# Altium schematic sheet EA08AI测试板.SchDoc
size 711 x 711 mm
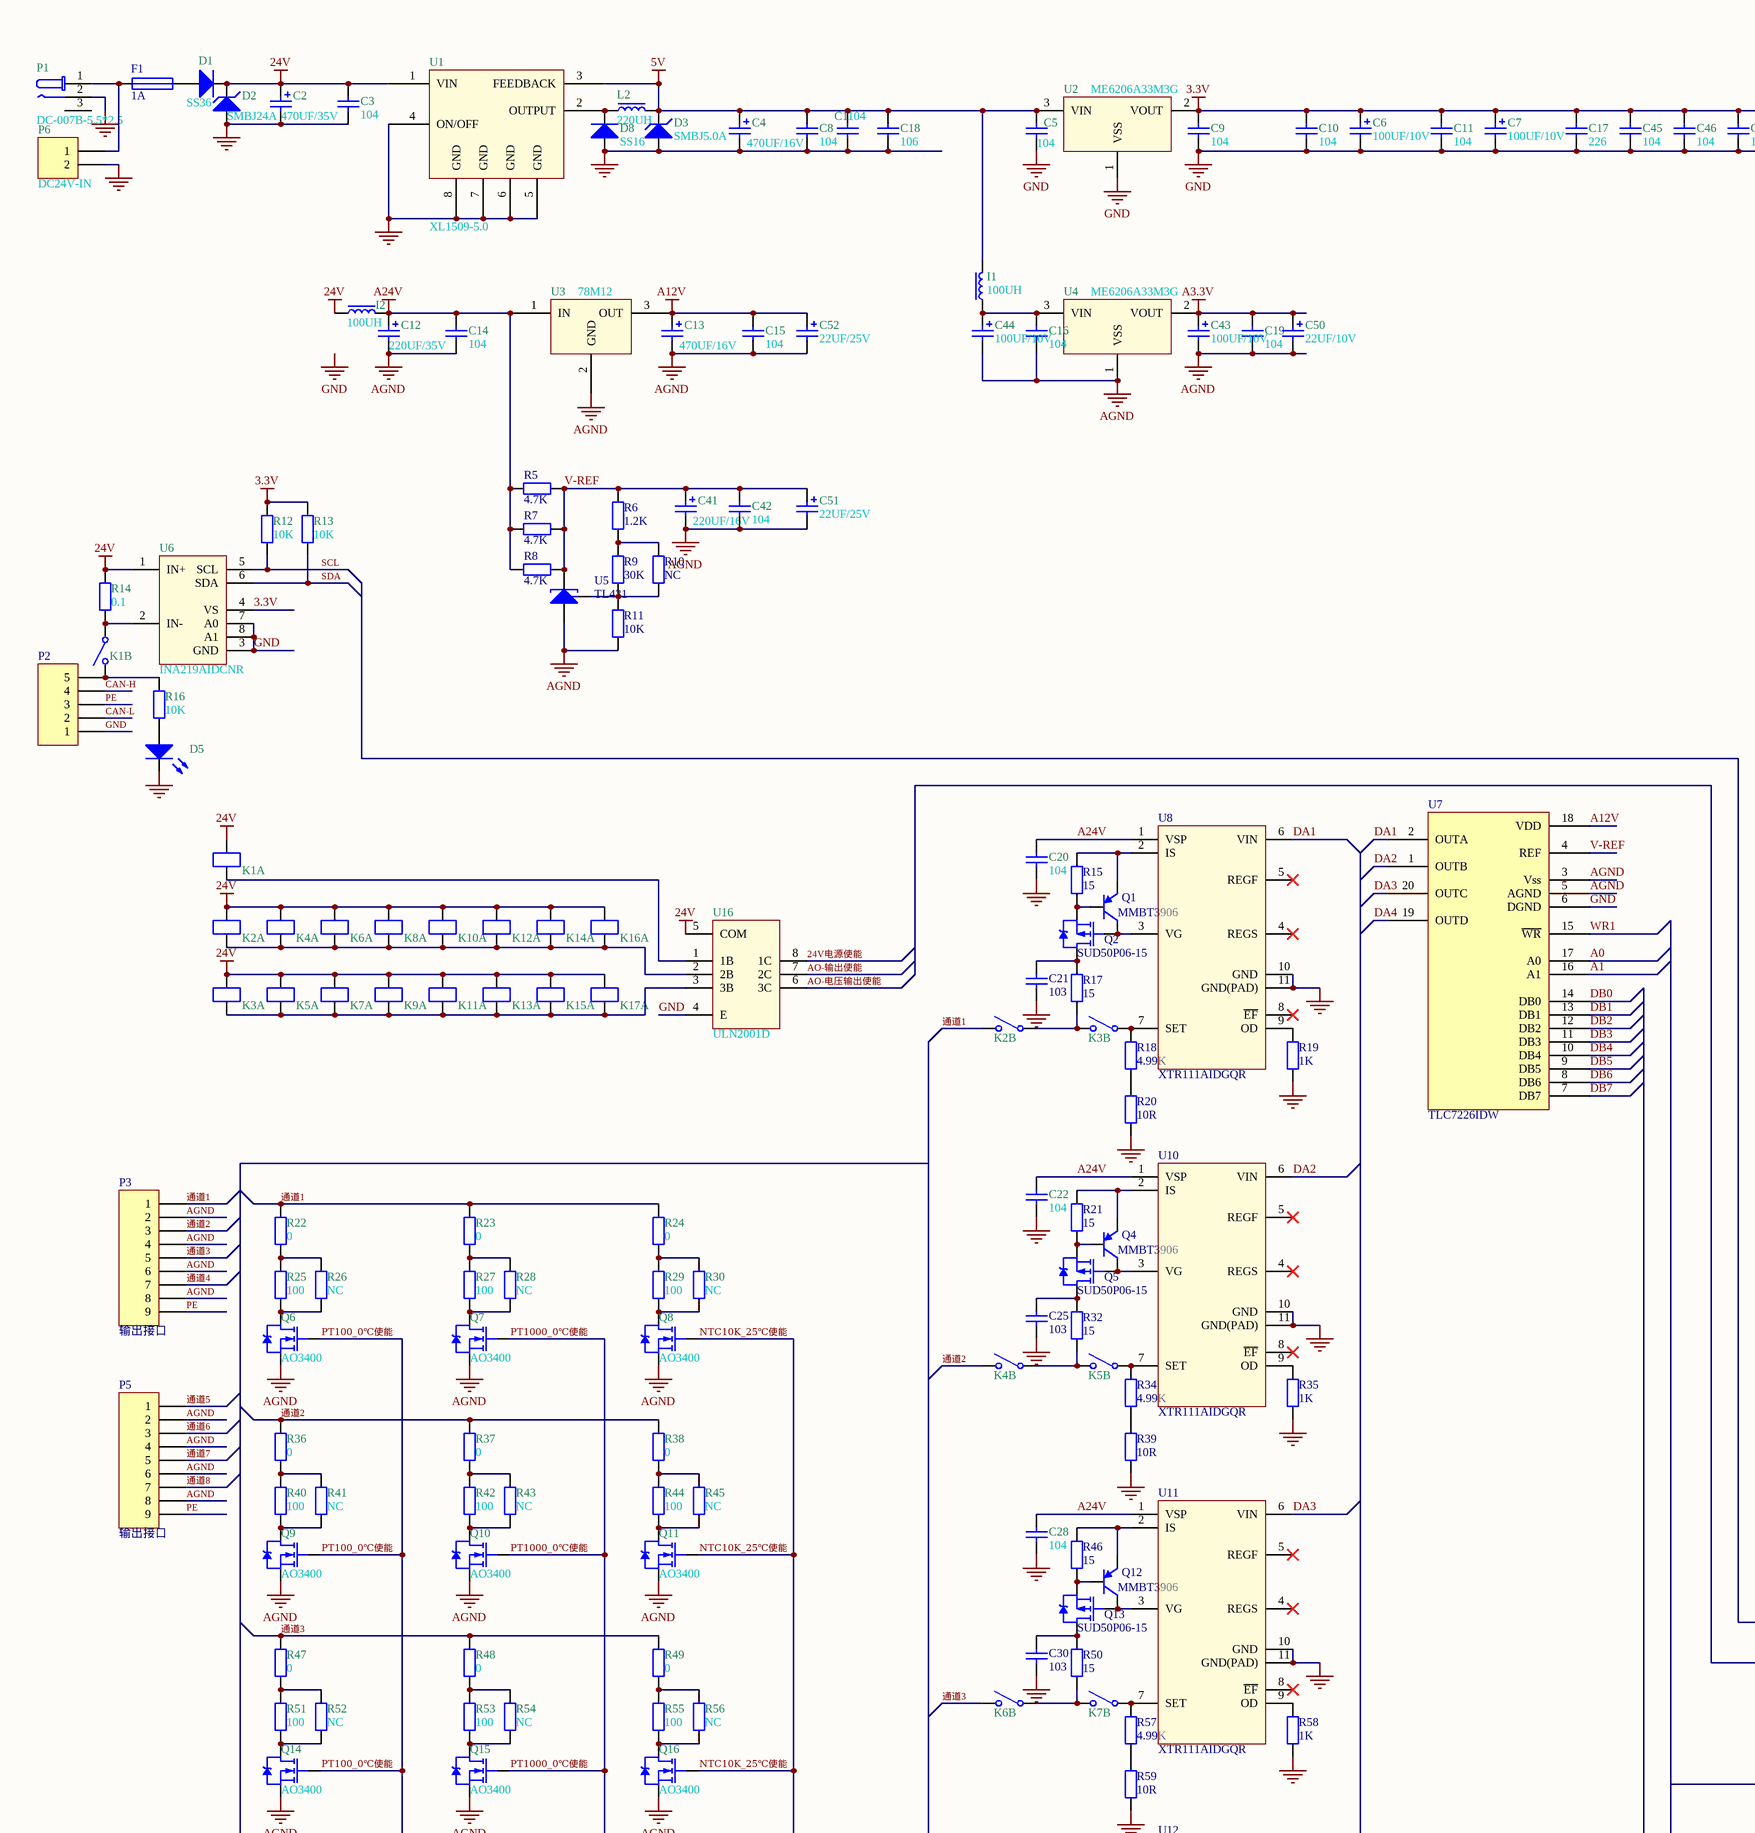
[diagram p0: EA08AI测试板.SchDoc, top left]
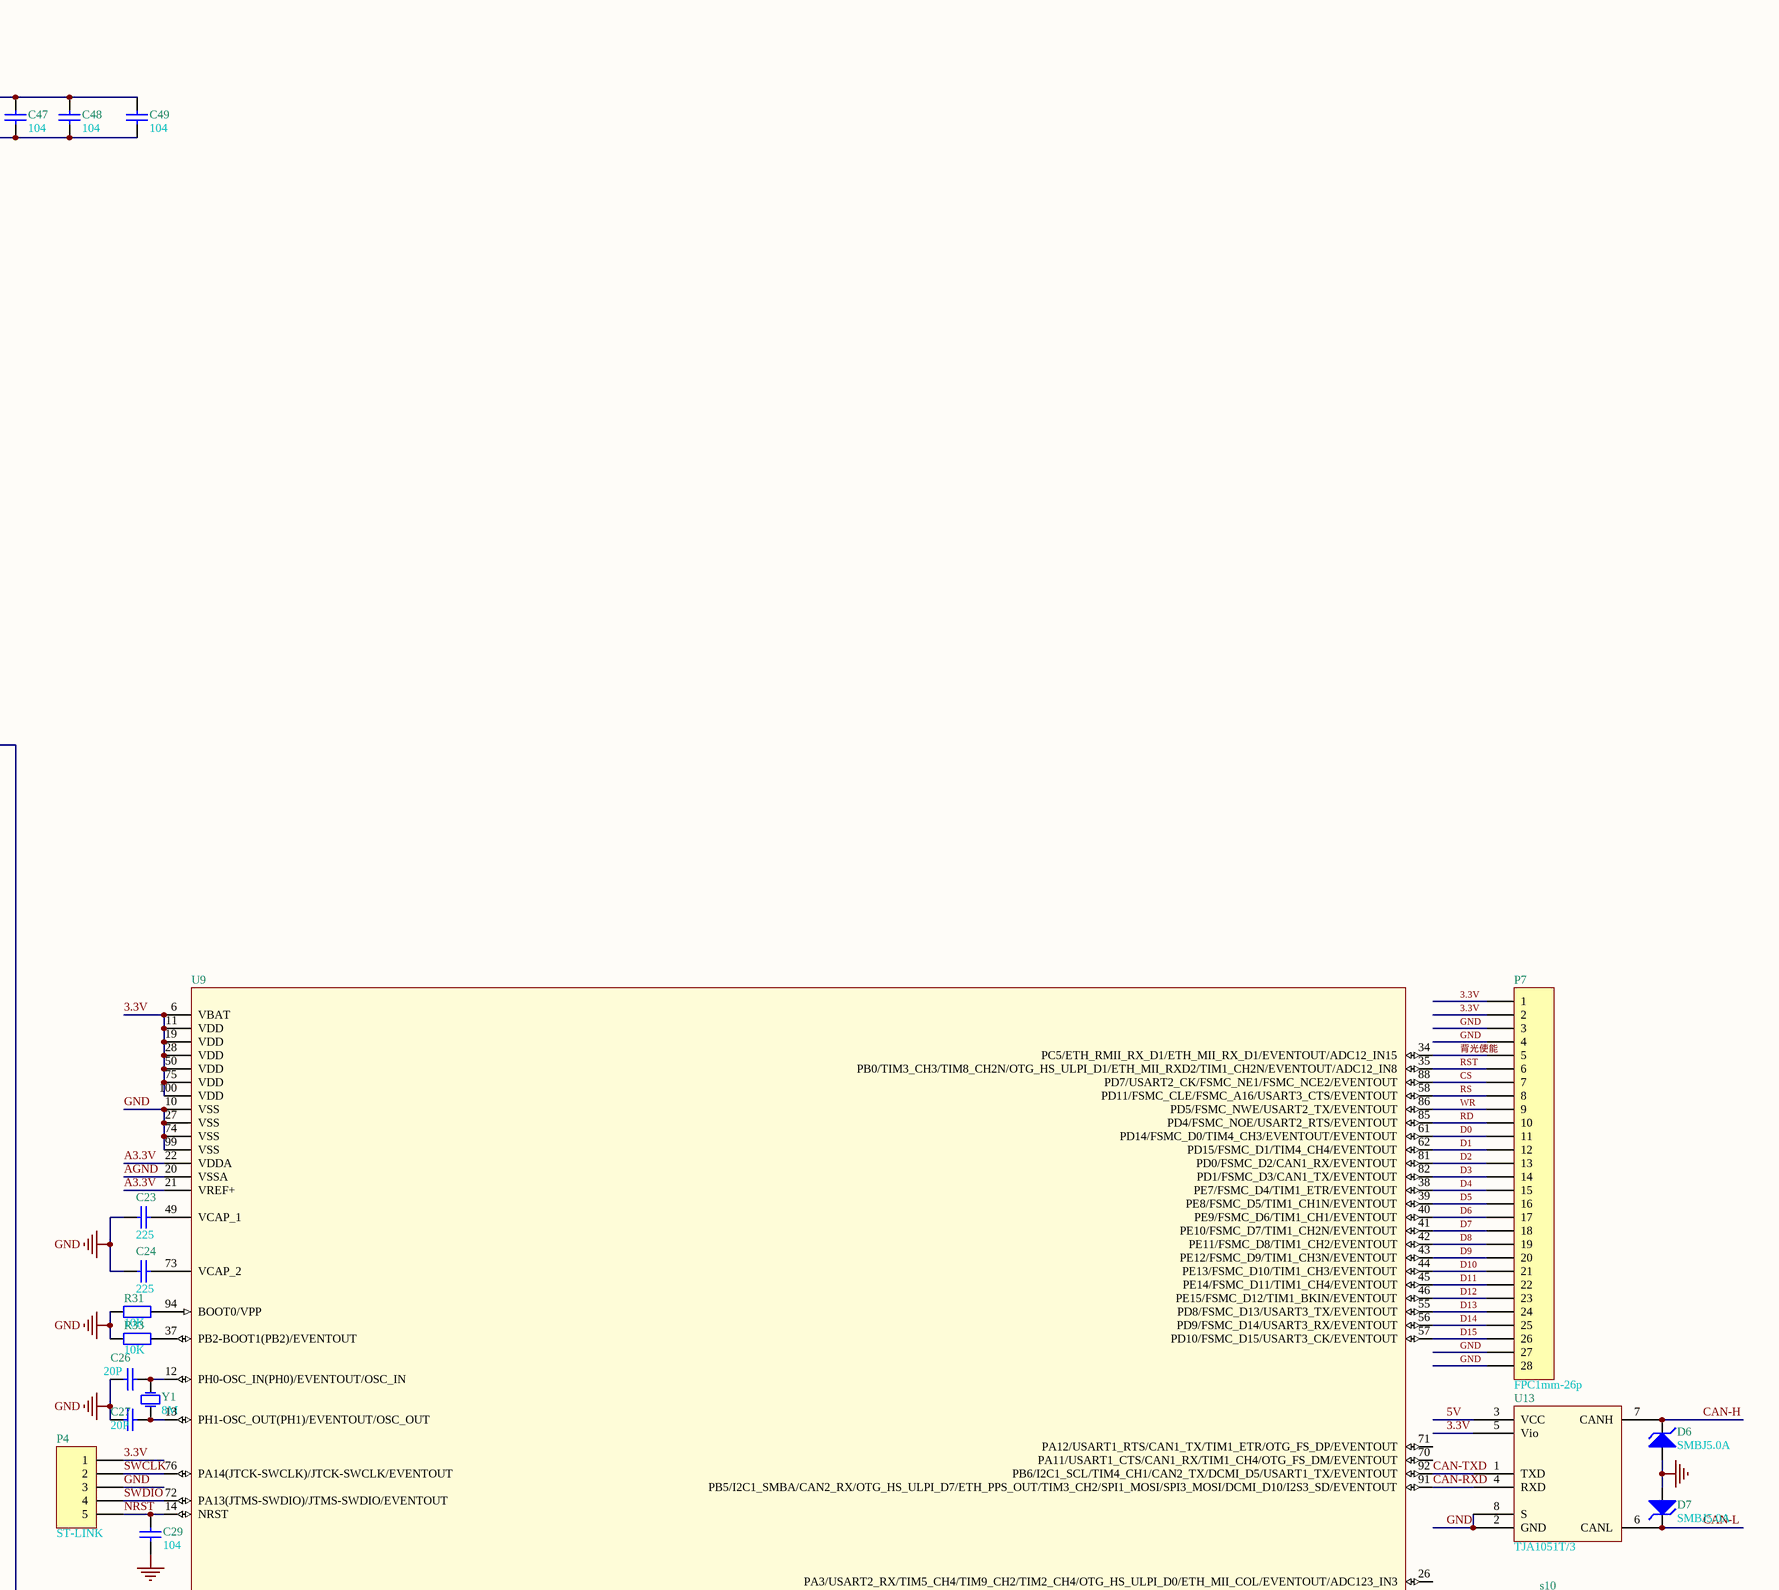
[diagram p1: EA08AI测试板.SchDoc, top right]
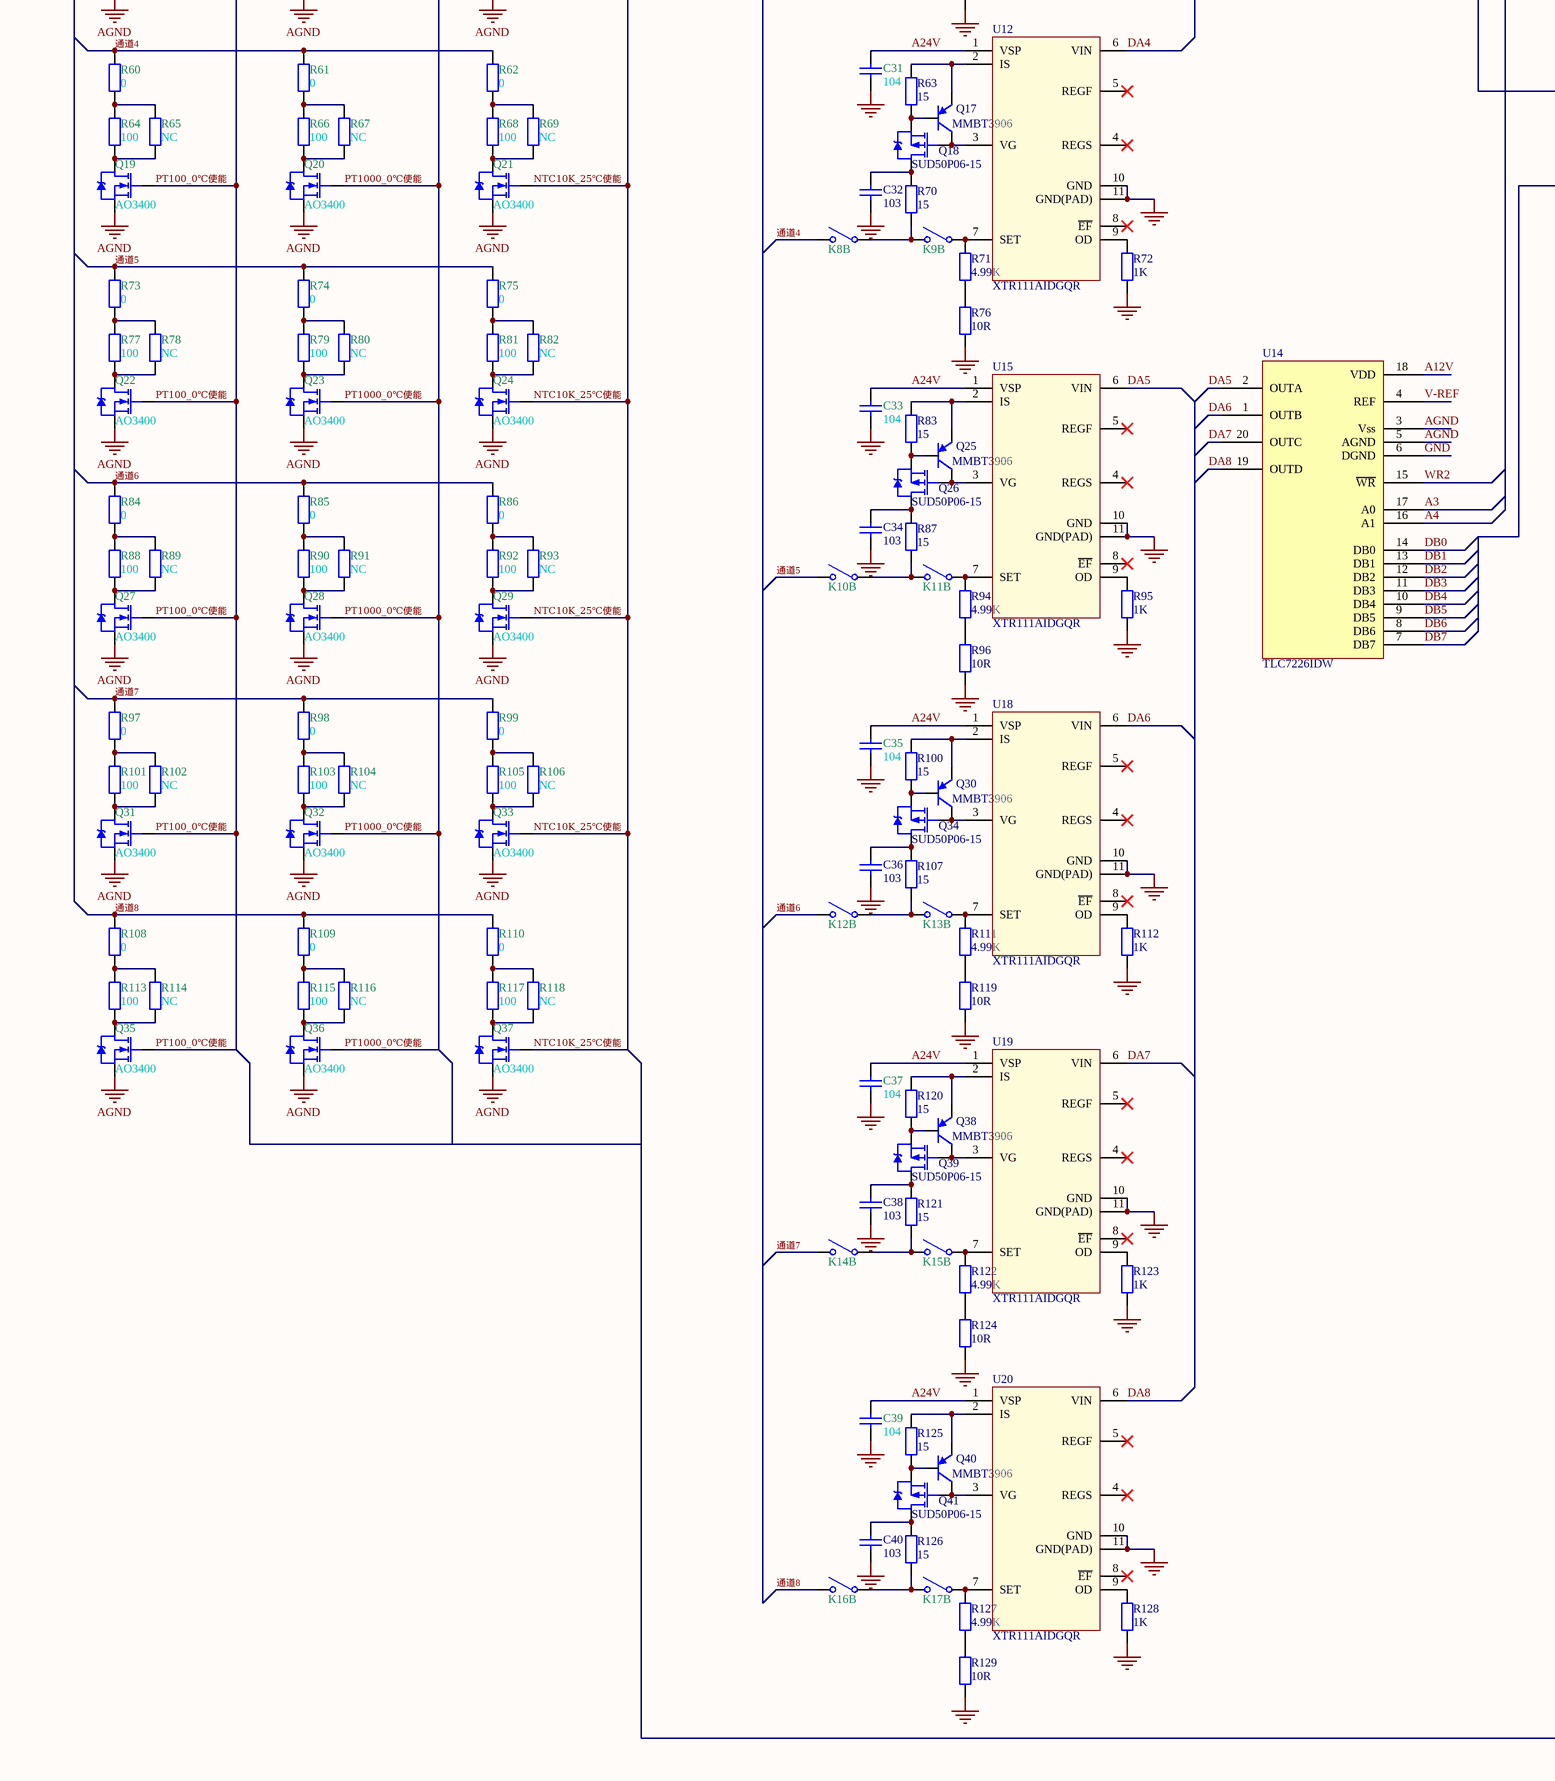
[diagram p2: EA08AI测试板.SchDoc, bottom left]
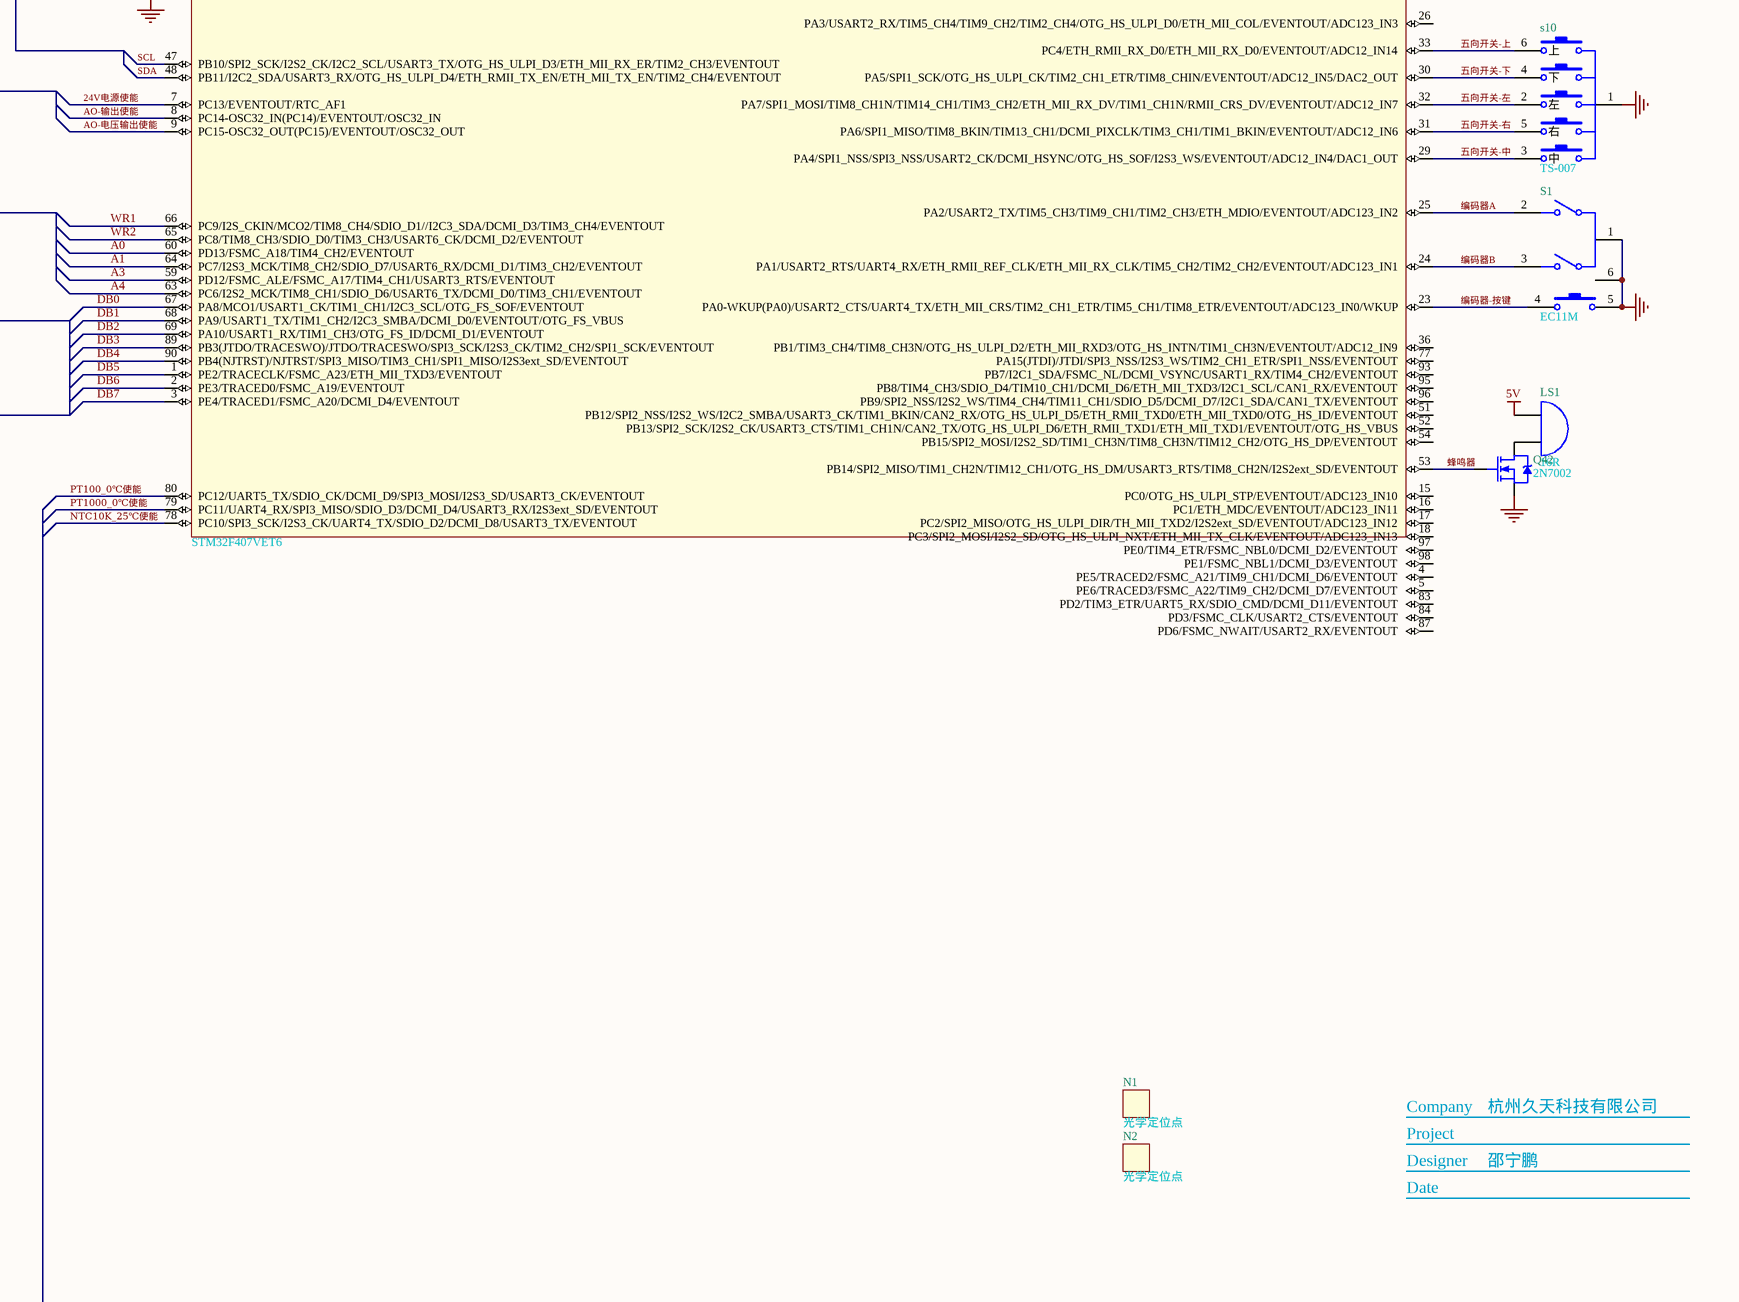
[diagram p3: EA08AI测试板.SchDoc, bottom right]

## Parts
C1  104  [C-0603]
C2  470UF/35V  [贴片固态电容10*10]
C3  104  [C-0603]
C4  470UF/16V  [贴片固态电容8*10-M]
C5  104  [C-0603]
C6  100UF/10V  [贴片固态电容5*5.3]
C7  100UF/10V  [C-7343]
C8  104  [C-0603]
C9  104  [C-0603]
C10  104  [C-0603]
C11  104  [C-0603]
C12  220UF/35V  [贴片固态电容8*10-M]
C13  470UF/16V  [贴片固态电容8*10-M]
C14  104  [C-0603]
C15  104  [C-0603]
C16  104  [C-0603]
C17  226  [C-0805]
C18  106  [C-0805]
C19  104  [C-0603]
C20  104  [C-0603]
C21  103  [C-0603]
C22  104  [C-0603]
C23  225  [C-0603]
C24  225  [C-0603]
C25  103  [C-0603]
C26  20P  [C-0603]
C27  20P  [C-0603]
C28  104  [C-0603]
C29  104  [C-0603]
C30  103  [C-0603]
C31  104  [C-0603]
C32  103  [C-0603]
C33  104  [C-0603]
C34  103  [C-0603]
C35  104  [C-0603]
C36  103  [C-0603]
C37  104  [C-0603]
C38  103  [C-0603]
C39  104  [C-0603]
C40  103  [C-0603]
C41  220UF/16V  [贴片固态电容6.3*7.7]
C42  104  [C-0603]
C43  100UF/10V  [贴片固态电容5*5.3]
C44  100UF/10V  [贴片固态电容5*5.3]
C45  104  [C-0603]
C46  104  [C-0603]
C47  104  [C-0603]
C48  104  [C-0603]
C49  104  [C-0603]
C50  22UF/10V  [C-3216]
C51  22UF/25V  [C-3528]
C52  22UF/25V  [C-3528]
D1  SS36  [SMB]
D2  SMBJ24A  [SMB]
D3  SMBJ5.0A  [SMB]
D5  (no value)  [LED-0603-GREEN]
D6  SMBJ5.0A  [SMB-N]
D7  SMBJ5.0A  [SMB-N]
D8  SS16  [SMA]
F1  1A  [FUSE-1808保险丝座]
I1  100UH  [CDRH74R]
I2  100UH  [CDRH74R]
K1  HF49FD-D24-1H11  [HF49FD-D24-1H11]  (value not drawn)  (parts A,B of 2)
K2  HF49FD-D24-1H11  [HF49FD-D24-1H11]  (value not drawn)  (parts A,B of 2)
K3  HF49FD-D24-1H11  [HF49FD-D24-1H11]  (value not drawn)  (parts A,B of 2)
K4  HF49FD-D24-1H11  [HF49FD-D24-1H11]  (value not drawn)  (parts A,B of 2)
K5  HF49FD-D24-1H11  [HF49FD-D24-1H11]  (value not drawn)  (parts A,B of 2)
K6  HF49FD-D24-1H11  [HF49FD-D24-1H11]  (value not drawn)  (parts A,B of 2)
K7  HF49FD-D24-1H11  [HF49FD-D24-1H11]  (value not drawn)  (parts A,B of 2)
K8  HF49FD-D24-1H11  [HF49FD-D24-1H11]  (value not drawn)  (parts A,B of 2)
K9  HF49FD-D24-1H11  [HF49FD-D24-1H11]  (value not drawn)  (parts A,B of 2)
K10  HF49FD-D24-1H11  [HF49FD-D24-1H11]  (value not drawn)  (parts A,B of 2)
K11  HF49FD-D24-1H11  [HF49FD-D24-1H11]  (value not drawn)  (parts A,B of 2)
K12  HF49FD-D24-1H11  [HF49FD-D24-1H11]  (value not drawn)  (parts A,B of 2)
K13  HF49FD-D24-1H11  [HF49FD-D24-1H11]  (value not drawn)  (parts A,B of 2)
K14  HF49FD-D24-1H11  [HF49FD-D24-1H11]  (value not drawn)  (parts A,B of 2)
K15  HF49FD-D24-1H11  [HF49FD-D24-1H11]  (value not drawn)  (parts A,B of 2)
K16  HF49FD-D24-1H11  [HF49FD-D24-1H11]  (value not drawn)  (parts A,B of 2)
K17  HF49FD-D24-1H11  [HF49FD-D24-1H11]  (value not drawn)  (parts A,B of 2)
L2  220UH  [CDRH127R]
LS1  16R  [蜂鸣器 YH-8503-A]
N1  光学定位点  [MARK-1mm-3mm]
N2  光学定位点  [MARK-1mm-3mm]
P1  DC-007B-5.5*2.5  [DC-007B]
P2  (no value)  [KF2EDGVC-5.08-5P弯针]
P3  输出接口  [KF2EDGVC-5.08-9P]
P4  ST-LINK  [HDR1X5]
P5  输出接口  [KF2EDGVC-5.08-9P]
P6  DC24V-IN  [KF2EDGVC-5.08-2P]
P7  FPC1mm-26p  [FPC-0.5mm_26P下接翻盖]
Q1  MMBT3906  [SOT-23]
Q2  SUD50P06-15  [TO-252]
Q4  MMBT3906  [SOT-23]
Q5  SUD50P06-15  [TO-252]
Q6  AO3400  [SOT-23]
Q7  AO3400  [SOT-23]
Q8  AO3400  [SOT-23]
Q9  AO3400  [SOT-23]
Q10  AO3400  [SOT-23]
Q11  AO3400  [SOT-23]
Q12  MMBT3906  [SOT-23]
Q13  SUD50P06-15  [TO-252]
Q14  AO3400  [SOT-23]
Q15  AO3400  [SOT-23]
Q16  AO3400  [SOT-23]
Q17  MMBT3906  [SOT-23]
Q18  SUD50P06-15  [TO-252]
Q19  AO3400  [SOT-23]
Q20  AO3400  [SOT-23]
Q21  AO3400  [SOT-23]
Q22  AO3400  [SOT-23]
Q23  AO3400  [SOT-23]
Q24  AO3400  [SOT-23]
Q25  MMBT3906  [SOT-23]
Q26  SUD50P06-15  [TO-252]
Q27  AO3400  [SOT-23]
Q28  AO3400  [SOT-23]
Q29  AO3400  [SOT-23]
Q30  MMBT3906  [SOT-23]
Q31  AO3400  [SOT-23]
Q32  AO3400  [SOT-23]
Q33  AO3400  [SOT-23]
Q34  SUD50P06-15  [TO-252]
Q35  AO3400  [SOT-23]
Q36  AO3400  [SOT-23]
Q37  AO3400  [SOT-23]
Q38  MMBT3906  [SOT-23]
Q39  SUD50P06-15  [TO-252]
Q40  MMBT3906  [SOT-23]
Q41  SUD50P06-15  [TO-252]
Q42  2N7002  [SOT-23]
R5  4.7K  [R-1206]
R6  1.2K  [R-0603]
R7  4.7K  [R-1206]
R8  4.7K  [R-1206]
R9  30K  [R-0603]
R10  NC  [R-0603]
R11  10K  [R-0603]
R12  10K  [R-0603]
R13  10K  [R-0603]
R14  0.1  [R-1206]
R15  15  [R-1206]
R16  10K  [R-0603]
R17  15  [R-1206]
R18  4.99K  [R-0603]
R19  1K  [R-0603]
R20  10R  [R-0603]
R21  15  [R-1206]
R22  0  [R-1206]
R23  0  [R-1206]
R24  0  [R-1206]
R25  100  [R-1206]
R26  NC  [R-1206]
R27  100  [R-1206]
R28  NC  [R-1206]
R29  100  [R-1206]
R30  NC  [R-1206]
R31  10K  [R-0603]
R32  15  [R-1206]
R33  10K  [R-0603]
R34  4.99K  [R-0603]
R35  1K  [R-0603]
R36  0  [R-1206]
R37  0  [R-1206]
R38  0  [R-1206]
R39  10R  [R-0603]
R40  100  [R-1206]
R41  NC  [R-1206]
R42  100  [R-1206]
R43  NC  [R-1206]
R44  100  [R-1206]
R45  NC  [R-1206]
R46  15  [R-1206]
R47  0  [R-1206]
R48  0  [R-1206]
R49  0  [R-1206]
R50  15  [R-1206]
R51  100  [R-1206]
R52  NC  [R-1206]
R53  100  [R-1206]
R54  NC  [R-1206]
R55  100  [R-1206]
R56  NC  [R-1206]
R57  4.99K  [R-0603]
R58  1K  [R-0603]
R59  10R  [R-0603]
R60  0  [R-1206]
R61  0  [R-1206]
R62  0  [R-1206]
R63  15  [R-1206]
R64  100  [R-1206]
R65  NC  [R-1206]
R66  100  [R-1206]
R67  NC  [R-1206]
R68  100  [R-1206]
R69  NC  [R-1206]
R70  15  [R-1206]
R71  4.99K  [R-0603]
R72  1K  [R-0603]
R73  0  [R-1206]
R74  0  [R-1206]
R75  0  [R-1206]
R76  10R  [R-0603]
R77  100  [R-1206]
R78  NC  [R-1206]
R79  100  [R-1206]
R80  NC  [R-1206]
R81  100  [R-1206]
R82  NC  [R-1206]
R83  15  [R-1206]
R84  0  [R-1206]
R85  0  [R-1206]
R86  0  [R-1206]
R87  15  [R-1206]
R88  100  [R-1206]
R89  NC  [R-1206]
R90  100  [R-1206]
R91  NC  [R-1206]
R92  100  [R-1206]
R93  NC  [R-1206]
R94  4.99K  [R-0603]
R95  1K  [R-0603]
R96  10R  [R-0603]
R97  0  [R-1206]
R98  0  [R-1206]
R99  0  [R-1206]
R100  15  [R-1206]
R101  100  [R-1206]
R102  NC  [R-1206]
R103  100  [R-1206]
R104  NC  [R-1206]
R105  100  [R-1206]
R106  NC  [R-1206]
R107  15  [R-1206]
R108  0  [R-1206]
R109  0  [R-1206]
R110  0  [R-1206]
R111  4.99K  [R-0603]
R112  1K  [R-0603]
R113  100  [R-1206]
R114  NC  [R-1206]
R115  100  [R-1206]
R116  NC  [R-1206]
R117  100  [R-1206]
R118  NC  [R-1206]
R119  10R  [R-0603]
R120  15  [R-1206]
R121  15  [R-1206]
R122  4.99K  [R-0603]
R123  1K  [R-0603]
R124  10R  [R-0603]
R125  15  [R-1206]
R126  15  [R-1206]
R127  4.99K  [R-0603]
R128  1K  [R-0603]
R129  10R  [R-0603]
S1  EC11M  [EC11M]
s10  TS-007  [TS-007]
U1  XL1509-5.0  [SOP-8-m]
U2  ME6206A33M3G  [SOT-23]
U3  78M12  [TO-252]
U4  ME6206A33M3G  [SOT-23]
U5  TL431  [SOT-23]
U6  INA219AIDCNR  [SOT-23-8-N]
U7  TLC7226IDW  [SOP-20]
U8  XTR111AIDGQR  [MSOP-10(11)-M]
U9  STM32F407VET6  [LQFP100]
U10  XTR111AIDGQR  [MSOP-10(11)-M]
U11  XTR111AIDGQR  [MSOP-10(11)-M]
U12  XTR111AIDGQR  [MSOP-10(11)-M]
U13  TJA1051T/3  [SOP-8-M]
U14  TLC7226IDW  [SOP-20]
U15  XTR111AIDGQR  [MSOP-10(11)-M]
U16  ULN2001D  [SOP-8-M]
U18  XTR111AIDGQR  [MSOP-10(11)-M]
U19  XTR111AIDGQR  [MSOP-10(11)-M]
U20  XTR111AIDGQR  [MSOP-10(11)-M]
Y1  8M  [HC-49SMD]

## Nets
3.3V: C6.1 C7.1 C9.2 C10.2 C11.2 C17.2 C45.2 C46.2 C47.2 C48.2 C49.2 P4.1 P7.1 P7.2 R12.1 R13.1 U2.2(VOUT) U6.4(VS) U9.6(VBAT) U9.11(VDD) U9.19(VDD) U9.28(VDD) U9.50(VDD) U9.75(VDD) U9.100(VDD) U13.5(Vio)
5V: C1.2 C4.1 C5.2 C8.2 C18.2 D3.2(K) I1.2 L2.2 LS1.1(A) U1.3(FEEDBACK) U2.3(VIN) U13.3(VCC)
24V: C2.1 C3.2 D1.2(K) D2.2(K) I2.1 K1.2 K2.2 K3.2 K4.2 K5.2 K6.2 K7.2 K8.2 K9.2 K10.2 K11.2 K12.2 K13.2 K14.2 K15.2 K16.2 K17.2 R14.2 U1.1(VIN) U6.1(IN+) U16.5(COM)
A3.3V: C19.2 C43.1 C50.1 U4.2(VOUT) U9.21(VREF+) U9.22(VDDA)
A12V: C13.1 C15.2 C52.1 U3.3(OUT) U7.18(VDD) U14.18(VDD)
A24V: C12.1 C14.2 C20.2 C22.2 C28.2 C31.2 C33.2 C35.2 C37.2 C39.2 I2.2 R5.2 R7.2 R8.2 U3.1(IN) U8.1(VSP) U10.1(VSP) U11.1(VSP) U12.1(VSP) U15.1(VSP) U18.1(VSP) U19.1(VSP) U20.1(VSP)
AGND: C12.2 C13.2 C14.1 C15.1 C16.1 C19.1 C20.1 C21.2 C22.1 C25.2 C28.1 C30.2 C31.1 C32.2 C33.1 C34.2 C35.1 C36.2 C37.1 C38.2 C39.1 C40.2 C41.2 C42.1 C43.2 C44.2 C50.2 C51.2 C52.2 P3.2 P3.4 P3.6 P3.8 P5.2 P5.4 P5.6 P5.8 Q6.2(S) Q7.2(S) Q8.2(S) Q9.2(S) Q10.2(S) Q11.2(S) Q14.2(S) Q15.2(S) Q16.2(S) Q19.2(S) Q20.2(S) Q21.2(S) Q22.2(S) Q23.2(S) Q24.2(S) Q27.2(S) Q28.2(S) Q29.2(S) Q31.2(S) Q32.2(S) Q33.2(S) Q35.2(S) Q36.2(S) Q37.2(S) R11.1 R19.2 R20.2 R35.2 R39.2 R58.2 R59.2 R72.2 R76.2 R95.2 R96.2 R112.2 R119.2 R123.2 R124.2 R128.2 R129.2 U3.2(GND) U4.1(VSS) U5.3(A) U7.3(Vss) U7.5(AGND) U8.10(GND) U8.11(GND(PAD)) U9.20(VSSA) U10.10(GND) U10.11(GND(PAD)) U11.10(GND) U11.11(GND(PAD)) U12.10(GND) U12.11(GND(PAD)) U14.3(Vss) U14.5(AGND) U15.10(GND) U15.11(GND(PAD)) U18.10(GND) U18.11(GND(PAD)) U19.10(GND) U19.11(GND(PAD)) U20.10(GND) U20.11(GND(PAD))
GND: C1.1 C2.2 C3.1 C4.2 C5.1 C6.2 C7.2 C8.1 C9.1 C10.1 C11.1 C17.1 C18.1 C23.1 C24.1 C26.1 C27.1 C29.1 C45.1 C46.1 C47.1 C48.1 C49.1 D2.1(A) D3.1(A) D5.2(K) D6.1(A) D7.1(A) D8.1(A) P1.2 P2.1 P4.3 P6.2 P7.3 P7.4 P7.27 P7.28 Q42.2(S) R31.2 R33.2 S1.1 S1.5 S1.6 s10.1(Common) U1.4(ON/OFF) U1.5(GND) U1.6(GND) U1.7(GND) U1.8(GND) U2.1(VSS) U6.3(GND) U6.7(A0) U6.8(A1) U7.6(DGND) U9.10(VSS) U9.27(VSS) U9.74(VSS) U9.99(VSS) U13.2(GND) U13.8(S) U14.6(DGND) U16.4(E)
24V电源使能: U9.7(PC13/EVENTOUT/RTC_AF1) U16.8(1C)
A0: U7.17(A0) U9.60(PD13/FSMC_A18/TIM4_CH2/EVENTOUT)
A1: U7.16(A1) U9.64(PC7/I2S3_MCK/TIM8_CH2/SDIO_D7/USART6_RX/DCMI_D1/TIM3_CH2/EVENTOUT)
A3: U9.59(PD12/FSMC_ALE/FSMC_A17/TIM4_CH1/USART3_RTS/EVENTOUT) U14.17(A0)
A4: U9.63(PC6/I2S2_MCK/TIM8_CH1/SDIO_D6/USART6_TX/DCMI_D0/TIM3_CH1/EVENTOUT) U14.16(A1)
AO-电压输出使能: U9.9(PC15-OSC32_OUT(PC15)/EVENTOUT/OSC32_OUT) U16.6(3C)
AO-输出使能: U9.8(PC14-OSC32_IN(PC14)/EVENTOUT/OSC32_IN) U16.7(2C)
CAN-H: D6.2(K) P2.4 U13.7(CANH)
CAN-L: D7.2(K) P2.2 U13.6(CANL)
CAN-RXD: U9.91(PB5/I2C1_SMBA/CAN2_RX/OTG_HS_ULPI_D7/ETH_PPS_OUT/TIM3_CH2/SPI1_MOSI/SPI3_MOSI/DCMI_D10/I2S3_SD/EVENTOUT) U13.4(RXD)
CAN-TXD: U9.92(PB6/I2C1_SCL/TIM4_CH1/CAN2_TX/DCMI_D5/USART1_TX/EVENTOUT) U13.1(TXD)
CS: P7.7 U9.88(PD7/USART2_CK/FSMC_NE1/FSMC_NCE2/EVENTOUT)
D0: P7.11 U9.61(PD14/FSMC_D0/TIM4_CH3/EVENTOUT/EVENTOUT)
D1: P7.12 U9.62(PD15/FSMC_D1/TIM4_CH4/EVENTOUT)
D2: P7.13 U9.81(PD0/FSMC_D2/CAN1_RX/EVENTOUT)
D3: P7.14 U9.82(PD1/FSMC_D3/CAN1_TX/EVENTOUT)
D4: P7.15 U9.38(PE7/FSMC_D4/TIM1_ETR/EVENTOUT)
D5: P7.16 U9.39(PE8/FSMC_D5/TIM1_CH1N/EVENTOUT)
D6: P7.17 U9.40(PE9/FSMC_D6/TIM1_CH1/EVENTOUT)
D7: P7.18 U9.41(PE10/FSMC_D7/TIM1_CH2N/EVENTOUT)
D8: P7.19 U9.42(PE11/FSMC_D8/TIM1_CH2/EVENTOUT)
D9: P7.20 U9.43(PE12/FSMC_D9/TIM1_CH3N/EVENTOUT)
D10: P7.21 U9.44(PE13/FSMC_D10/TIM1_CH3/EVENTOUT)
D11: P7.22 U9.45(PE14/FSMC_D11/TIM1_CH4/EVENTOUT)
D12: P7.23 U9.46(PE15/FSMC_D12/TIM1_BKIN/EVENTOUT)
D13: P7.24 U9.55(PD8/FSMC_D13/USART3_TX/EVENTOUT)
D14: P7.25 U9.56(PD9/FSMC_D14/USART3_RX/EVENTOUT)
D15: P7.26 U9.57(PD10/FSMC_D15/USART3_CK/EVENTOUT)
DA1: U7.2(OUTA) U8.6(VIN)
DA2: U7.1(OUTB) U10.6(VIN)
DA3: U7.20(OUTC) U11.6(VIN)
DA4: U7.19(OUTD) U12.6(VIN)
DA5: U14.2(OUTA) U15.6(VIN)
DA6: U14.1(OUTB) U18.6(VIN)
DA7: U14.20(OUTC) U19.6(VIN)
DA8: U14.19(OUTD) U20.6(VIN)
DB0: U7.14(DB0) U9.67(PA8/MCO1/USART1_CK/TIM1_CH1/I2C3_SCL/OTG_FS_SOF/EVENTOUT) U14.14(DB0)
DB1: U7.13(DB1) U9.68(PA9/USART1_TX/TIM1_CH2/I2C3_SMBA/DCMI_D0/EVENTOUT/OTG_FS_VBUS) U14.13(DB1)
DB2: U7.12(DB2) U9.69(PA10/USART1_RX/TIM1_CH3/OTG_FS_ID/DCMI_D1/EVENTOUT) U14.12(DB2)
DB3: U7.11(DB3) U9.89(PB3(JTDO/TRACESWO)/JTDO/TRACESWO/SPI3_SCK/I2S3_CK/TIM2_CH2/SPI1_SCK/EVENTOUT) U14.11(DB3)
DB4: U7.10(DB4) U9.90(PB4(NJTRST)/NJTRST/SPI3_MISO/TIM3_CH1/SPI1_MISO/I2S3ext_SD/EVENTOUT) U14.10(DB4)
DB5: U7.9(DB5) U9.1(PE2/TRACECLK/FSMC_A23/ETH_MII_TXD3/EVENTOUT) U14.9(DB5)
DB6: U7.8(DB6) U9.2(PE3/TRACED0/FSMC_A19/EVENTOUT) U14.8(DB6)
DB7: U7.7(DB7) U9.3(PE4/TRACED1/FSMC_A20/DCMI_D4/EVENTOUT) U14.7(DB7)
NRST: C29.2 P4.5 U9.14(NRST)
NTC10K_25℃使能: Q8.1(G) Q11.1(G) Q16.1(G) Q21.1(G) Q24.1(G) Q29.1(G) Q33.1(G) Q37.1(G) U9.78(PC10/SPI3_SCK/I2S3_CK/UART4_TX/SDIO_D2/DCMI_D8/USART3_TX/EVENTOUT)
PE: P2.3 P3.9 P5.9
PT100_0℃使能: Q6.1(G) Q9.1(G) Q14.1(G) Q19.1(G) Q22.1(G) Q27.1(G) Q31.1(G) Q35.1(G) U9.80(PC12/UART5_TX/SDIO_CK/DCMI_D9/SPI3_MOSI/I2S3_SD/USART3_CK/EVENTOUT)
PT1000_0℃使能: Q7.1(G) Q10.1(G) Q15.1(G) Q20.1(G) Q23.1(G) Q28.1(G) Q32.1(G) Q36.1(G) U9.79(PC11/UART4_RX/SPI3_MISO/SDIO_D3/DCMI_D4/USART3_RX/I2S3ext_SD/EVENTOUT)
RD: P7.10 U9.85(PD4/FSMC_NOE/USART2_RTS/EVENTOUT)
RS: P7.8 U9.58(PD11/FSMC_CLE/FSMC_A16/USART3_CTS/EVENTOUT)
RST: P7.6 U9.35(PB0/TIM3_CH3/TIM8_CH2N/OTG_HS_ULPI_D1/ETH_MII_RXD2/TIM1_CH2N/EVENTOUT/ADC12_IN8)
SCL: R12.2 U6.5(SCL) U9.47(PB10/SPI2_SCK/I2S2_CK/I2C2_SCL/USART3_TX/OTG_HS_ULPI_D3/ETH_MII_RX_ER/TIM2_CH3/EVENTOUT)
SDA: R13.2 U6.6(SDA) U9.48(PB11/I2C2_SDA/USART3_RX/OTG_HS_ULPI_D4/ETH_RMII_TX_EN/ETH_MII_TX_EN/TIM2_CH4/EVENTOUT)
SWCLK: P4.2 U9.76(PA14(JTCK-SWCLK)/JTCK-SWCLK/EVENTOUT)
SWDIO: P4.4 U9.72(PA13(JTMS-SWDIO)/JTMS-SWDIO/EVENTOUT)
V-REF: C41.1 C42.2 C51.1 R5.1 R6.2 R7.1 R8.1 U5.2(K) U7.4(REF) U14.4(REF)
WR: P7.9 U9.86(PD5/FSMC_NWE/USART2_TX/EVENTOUT)
WR1: U7.15(~{WR}) U9.66(PC9/I2S_CKIN/MCO2/TIM8_CH4/SDIO_D1//I2C3_SDA/DCMI_D3/TIM3_CH4/EVENTOUT)
WR2: U9.65(PC8/TIM8_CH3/SDIO_D0/TIM3_CH3/USART6_CK/DCMI_D2/EVENTOUT) U14.15(~{WR})
五向开关-上: s10.6(上) U9.33(PC4/ETH_RMII_RX_D0/ETH_MII_RX_D0/EVENTOUT/ADC12_IN14)
五向开关-下: s10.4(下) U9.30(PA5/SPI1_SCK/OTG_HS_ULPI_CK/TIM2_CH1_ETR/TIM8_CHIN/EVENTOUT/ADC12_IN5/DAC2_OUT)
五向开关-中: s10.3(中) U9.29(PA4/SPI1_NSS/SPI3_NSS/USART2_CK/DCMI_HSYNC/OTG_HS_SOF/I2S3_WS/EVENTOUT/ADC12_IN4/DAC1_OUT)
五向开关-右: s10.5(右) U9.31(PA6/SPI1_MISO/TIM8_BKIN/TIM13_CH1/DCMI_PIXCLK/TIM3_CH1/TIM1_BKIN/EVENTOUT/ADC12_IN6)
五向开关-左: s10.2(左) U9.32(PA7/SPI1_MOSI/TIM8_CH1N/TIM14_CH1/TIM3_CH2/ETH_MII_RX_DV/TIM1_CH1N/RMII_CRS_DV/EVENTOUT/ADC12_IN7)
编码器-按键: S1.4 U9.23(PA0-WKUP(PA0)/USART2_CTS/UART4_TX/ETH_MII_CRS/TIM2_CH1_ETR/TIM5_CH1/TIM8_ETR/EVENTOUT/ADC123_IN0/WKUP)
编码器A: S1.2 U9.25(PA2/USART2_TX/TIM5_CH3/TIM9_CH1/TIM2_CH3/ETH_MDIO/EVENTOUT/ADC123_IN2)
编码器B: S1.3 U9.24(PA1/USART2_RTS/UART4_RX/ETH_RMII_REF_CLK/ETH_MII_RX_CLK/TIM5_CH2/TIM2_CH2/EVENTOUT/ADC123_IN1)
背光使能: P7.5 U9.34(PC5/ETH_RMII_RX_D1/ETH_MII_RX_D1/EVENTOUT/ADC12_IN15)
蜂鸣器: Q42.1(G) U9.53(PB14/SPI2_MISO/TIM1_CH2N/TIM12_CH1/OTG_HS_DM/USART3_RTS/TIM8_CH2N/I2S2ext_SD/EVENTOUT)
通道1: K2.4 P3.1 R22.2 R23.2 R24.2
通道2: K4.4 P3.3 R36.2 R37.2 R38.2
通道3: K6.4 P3.5 R47.2 R48.2 R49.2
通道4: K8.4 P3.7 R60.2 R61.2 R62.2
通道5: K10.4 P5.1 R73.2 R74.2 R75.2
通道6: K12.4 P5.3 R84.2 R85.2 R86.2
通道7: K14.4 P5.5 R97.2 R98.2 R99.2
通道8: K16.4 P5.7 R108.2 R109.2 R110.2
NetC16_2: C16.2 C44.1 I1.1 U4.3(VIN)
NetC21_1: C21.1 Q2.2(D) R17.1
NetC23_2: C23.2 U9.49(VCAP_1)
NetC24_2: C24.2 U9.73(VCAP_2)
NetC25_1: C25.1 Q5.2(D) R32.1
NetC26_2: C26.2 U9.12(PH0-OSC_IN(PH0)/EVENTOUT/OSC_IN) Y1.2(OSC2)
NetC27_2: C27.2 U9.13(PH1-OSC_OUT(PH1)/EVENTOUT/OSC_OUT) Y1.1(OSC1)
NetC30_1: C30.1 Q13.2(D) R50.1
NetC32_1: C32.1 Q18.2(D) R70.1
NetC34_1: C34.1 Q26.2(D) R87.1
NetC36_1: C36.1 Q34.2(D) R107.1
NetC38_1: C38.1 Q39.2(D) R121.1
NetC40_1: C40.1 Q41.2(D) R126.1
NetD1_1: D1.1(A) F1.2
NetD5_1: D5.1(A) R16.2
NetD8_2: D8.2(K) L2.1 U1.2(OUTPUT)
NetF1_1: F1.1 P1.1 P6.1
NetK1_1: K1.1 U16.1(1B)
NetK1_3: K1.3 R14.1 U6.2(IN-)
NetK1_4: K1.4 P2.5 R16.1
NetK2_1: K2.1 K4.1 K6.1 K8.1 K10.1 K12.1 K14.1 K16.1 U16.2(2B)
NetK2_3: K2.3 K3.4 R17.2
NetK3_1: K3.1 K5.1 K7.1 K9.1 K11.1 K13.1 K15.1 K17.1 U16.3(3B)
NetK3_3: K3.3 R18.1 U8.7(SET)
NetK4_3: K4.3 K5.4 R32.2
NetK5_3: K5.3 R34.1 U10.7(SET)
NetK6_3: K6.3 K7.4 R50.2
NetK7_3: K7.3 R57.1 U11.7(SET)
NetK8_3: K8.3 K9.4 R70.2
NetK9_3: K9.3 R71.1 U12.7(SET)
NetK10_3: K10.3 K11.4 R87.2
NetK11_3: K11.3 R94.1 U15.7(SET)
NetK12_3: K12.3 K13.4 R107.2
NetK13_3: K13.3 R111.1 U18.7(SET)
NetK14_3: K14.3 K15.4 R121.2
NetK15_3: K15.3 R122.1 U19.7(SET)
NetK16_3: K16.3 K17.4 R126.2
NetK17_3: K17.3 R127.1 U20.7(SET)
NetLS1_2: LS1.2(B) Q42.3(D)
NetQ1_1: Q1.1(B) Q2.3(S) R15.2
NetQ1_2: Q1.2(E) R15.1 U8.2(IS)
NetQ1_3: Q1.3(C) Q2.1(G) U8.3(VG)
NetQ4_1: Q4.1(B) Q5.3(S) R21.2
NetQ4_2: Q4.2(E) R21.1 U10.2(IS)
NetQ4_3: Q4.3(C) Q5.1(G) U10.3(VG)
NetQ6_3: Q6.3(D) R25.1 R26.1
NetQ7_3: Q7.3(D) R27.1 R28.1
NetQ8_3: Q8.3(D) R29.1 R30.1
NetQ9_3: Q9.3(D) R40.1 R41.1
NetQ10_3: Q10.3(D) R42.1 R43.1
NetQ11_3: Q11.3(D) R44.1 R45.1
NetQ12_1: Q12.1(B) Q13.3(S) R46.2
NetQ12_2: Q12.2(E) R46.1 U11.2(IS)
NetQ12_3: Q12.3(C) Q13.1(G) U11.3(VG)
NetQ14_3: Q14.3(D) R51.1 R52.1
NetQ15_3: Q15.3(D) R53.1 R54.1
NetQ16_3: Q16.3(D) R55.1 R56.1
NetQ17_1: Q17.1(B) Q18.3(S) R63.2
NetQ17_2: Q17.2(E) R63.1 U12.2(IS)
NetQ17_3: Q17.3(C) Q18.1(G) U12.3(VG)
NetQ19_3: Q19.3(D) R64.1 R65.1
NetQ20_3: Q20.3(D) R66.1 R67.1
NetQ21_3: Q21.3(D) R68.1 R69.1
NetQ22_3: Q22.3(D) R77.1 R78.1
NetQ23_3: Q23.3(D) R79.1 R80.1
NetQ24_3: Q24.3(D) R81.1 R82.1
NetQ25_1: Q25.1(B) Q26.3(S) R83.2
NetQ25_2: Q25.2(E) R83.1 U15.2(IS)
NetQ25_3: Q25.3(C) Q26.1(G) U15.3(VG)
NetQ27_3: Q27.3(D) R88.1 R89.1
NetQ28_3: Q28.3(D) R90.1 R91.1
NetQ29_3: Q29.3(D) R92.1 R93.1
NetQ30_1: Q30.1(B) Q34.3(S) R100.2
NetQ30_2: Q30.2(E) R100.1 U18.2(IS)
NetQ30_3: Q30.3(C) Q34.1(G) U18.3(VG)
NetQ31_3: Q31.3(D) R101.1 R102.1
NetQ32_3: Q32.3(D) R103.1 R104.1
NetQ33_3: Q33.3(D) R105.1 R106.1
NetQ35_3: Q35.3(D) R113.1 R114.1
NetQ36_3: Q36.3(D) R115.1 R116.1
NetQ37_3: Q37.3(D) R117.1 R118.1
NetQ38_1: Q38.1(B) Q39.3(S) R120.2
NetQ38_2: Q38.2(E) R120.1 U19.2(IS)
NetQ38_3: Q38.3(C) Q39.1(G) U19.3(VG)
NetQ40_1: Q40.1(B) Q41.3(S) R125.2
NetQ40_2: Q40.2(E) R125.1 U20.2(IS)
NetQ40_3: Q40.3(C) Q41.1(G) U20.3(VG)
NetR6_1: R6.1 R9.2 R10.2
NetR9_1: R9.1 R10.1 R11.2 U5.1(REF)
NetR18_2: R18.2 R20.1
NetR19_1: R19.1 U8.9(OD)
NetR22_1: R22.1 R25.2 R26.2
NetR23_1: R23.1 R27.2 R28.2
NetR24_1: R24.1 R29.2 R30.2
NetR31_1: R31.1 U9.94(BOOT0/VPP)
NetR33_1: R33.1 U9.37(PB2-BOOT1(PB2)/EVENTOUT)
NetR34_2: R34.2 R39.1
NetR35_1: R35.1 U10.9(OD)
NetR36_1: R36.1 R40.2 R41.2
NetR37_1: R37.1 R42.2 R43.2
NetR38_1: R38.1 R44.2 R45.2
NetR47_1: R47.1 R51.2 R52.2
NetR48_1: R48.1 R53.2 R54.2
NetR49_1: R49.1 R55.2 R56.2
NetR57_2: R57.2 R59.1
NetR58_1: R58.1 U11.9(OD)
NetR60_1: R60.1 R64.2 R65.2
NetR61_1: R61.1 R66.2 R67.2
NetR62_1: R62.1 R68.2 R69.2
NetR71_2: R71.2 R76.1
NetR72_1: R72.1 U12.9(OD)
NetR73_1: R73.1 R77.2 R78.2
NetR74_1: R74.1 R79.2 R80.2
NetR75_1: R75.1 R81.2 R82.2
NetR84_1: R84.1 R88.2 R89.2
NetR85_1: R85.1 R90.2 R91.2
NetR86_1: R86.1 R92.2 R93.2
NetR94_2: R94.2 R96.1
NetR95_1: R95.1 U15.9(OD)
NetR97_1: R97.1 R101.2 R102.2
NetR98_1: R98.1 R103.2 R104.2
NetR99_1: R99.1 R105.2 R106.2
NetR108_1: R108.1 R113.2 R114.2
NetR109_1: R109.1 R115.2 R116.2
NetR110_1: R110.1 R117.2 R118.2
NetR111_2: R111.2 R119.1
NetR112_1: R112.1 U18.9(OD)
NetR122_2: R122.2 R124.1
NetR123_1: R123.1 U19.9(OD)
NetR127_2: R127.2 R129.1
NetR128_1: R128.1 U20.9(OD)

Not connected (* = marked no-connect by the designer): P1 3(NC); U8 4(REGS)* 5(REGF)* 8(~{EF})*; U9 4(PE5/TRACED2/FSMC_A21/TIM9_CH1/DCMI_D6/EVENTOUT) 5(PE6/TRACED3/FSMC_A22/TIM9_CH2/DCMI_D7/EVENTOUT) 15(PC0/OTG_HS_ULPI_STP/EVENTOUT/ADC123_IN10) 16(PC1/ETH_MDC/EVENTOUT/ADC123_IN11) 17(PC2/SPI2_MISO/OTG_HS_ULPI_DIR/TH_MII_TXD2/I2S2ext_SD/EVENTOUT/ADC123_IN12) 18(PC3/SPI2_MOSI/I2S2_SD/OTG_HS_ULPI_NXT/ETH_MII_TX_CLK/EVENTOUT/ADC123_IN13) 26(PA3/USART2_RX/TIM5_CH4/TIM9_CH2/TIM2_CH4/OTG_HS_ULPI_D0/ETH_MII_COL/EVENTOUT/ADC123_IN3) 36(PB1/TIM3_CH4/TIM8_CH3N/OTG_HS_ULPI_D2/ETH_MII_RXD3/OTG_HS_INTN/TIM1_CH3N/EVENTOUT/ADC12_IN9) 51(PB12/SPI2_NSS/I2S2_WS/I2C2_SMBA/USART3_CK/TIM1_BKIN/CAN2_RX/OTG_HS_ULPI_D5/ETH_RMII_TXD0/ETH_MII_TXD0/OTG_HS_ID/EVENTOUT) 52(PB13/SPI2_SCK/I2S2_CK/USART3_CTS/TIM1_CH1N/CAN2_TX/OTG_HS_ULPI_D6/ETH_RMII_TXD1/ETH_MII_TXD1/EVENTOUT/OTG_HS_VBUS) 54(PB15/SPI2_MOSI/I2S2_SD/TIM1_CH3N/TIM8_CH3N/TIM12_CH2/OTG_HS_DP/EVENTOUT) 70(PA11/USART1_CTS/CAN1_RX/TIM1_CH4/OTG_FS_DM/EVENTOUT) 71(PA12/USART1_RTS/CAN1_TX/TIM1_ETR/OTG_FS_DP/EVENTOUT) 77(PA15(JTDI)/JTDI/SPI3_NSS/I2S3_WS/TIM2_CH1_ETR/SPI1_NSS/EVENTOUT) 83(PD2/TIM3_ETR/UART5_RX/SDIO_CMD/DCMI_D11/EVENTOUT) 84(PD3/FSMC_CLK/USART2_CTS/EVENTOUT) 87(PD6/FSMC_NWAIT/USART2_RX/EVENTOUT) 93(PB7/I2C1_SDA/FSMC_NL/DCMI_VSYNC/USART1_RX/TIM4_CH2/EVENTOUT) 95(PB8/TIM4_CH3/SDIO_D4/TIM10_CH1/DCMI_D6/ETH_MII_TXD3/I2C1_SCL/CAN1_RX/EVENTOUT) 96(PB9/SPI2_NSS/I2S2_WS/TIM4_CH4/TIM11_CH1/SDIO_D5/DCMI_D7/I2C1_SDA/CAN1_TX/EVENTOUT) 97(PE0/TIM4_ETR/FSMC_NBL0/DCMI_D2/EVENTOUT) 98(PE1/FSMC_NBL1/DCMI_D3/EVENTOUT); U10 4(REGS)* 5(REGF)* 8(~{EF})*; U11 4(REGS)* 5(REGF)* 8(~{EF})*; U12 4(REGS)* 5(REGF)* 8(~{EF})*; U15 4(REGS)* 5(REGF)* 8(~{EF})*; U18 4(REGS)* 5(REGF)* 8(~{EF})*; U19 4(REGS)* 5(REGF)* 8(~{EF})*; U20 4(REGS)* 5(REGF)* 8(~{EF})*

## Notes on the sheet
- Company
- 杭州久天科技有限公司
- Project
- Designer
- Date
- 邵宁鹏
- Labels drawn without touching a wire or pin: GND

## Library data of the parts
C1 C3 C5 C8-C11 C14-C20 C22 C28 C31 C33 C35 C37 C39 C42 C45-C49 = Cap: Capacitor; Published: 8-Jun-2000; LatestRevisionDate: 17-Jul-2002; LatestRevisionNote: Re-released for DXP Platform.; PackageReference: RAD-0.3; Publisher: Altium Limited
C2 C12 = Cap Pol1: 电解电容; Published: 8-Jun-2000; LatestRevisionDate: 17-Jul-2002; LatestRevisionNote: Re-released for DXP Platform.; PackageReference: RB7.6-15; Publisher: Altium Limited
C4 C6 C7 C13 C41 C43 C44 C50-C52 = Cap Pol1: Polarized Capacitor (Radial); Published: 8-Jun-2000; LatestRevisionDate: 17-Jul-2002; LatestRevisionNote: Re-released for DXP Platform.; PackageReference: RB7.6-15; Publisher: Altium Limited
C21 C23-C27 C29 C30 C32 C34 C36 C38 C40 = Cap-0603: 0805; Published: 8-Jun-2000; LatestRevisionDate: 17-Jul-2002; LatestRevisionNote: Re-released for DXP Platform.; PackageReference: RAD-0.3; Publisher: Altium Limited
D1 = SS36: SMB; Published: 8-Jun-2000; LatestRevisionDate: 17-Jul-2002; LatestRevisionNote: Re-released for DXP Platform.; DatasheetVersion: Aug-1984; PackageReference: DO-201AD; Publisher: Altium Limited; ComponentLink1Description: Manufacturer Link; ComponentLink1URL: http://www.irf.com/
D2 D3 D6 D7 = TVS-1: SMB
D5 = LED-0603-Blue: Published: 8-Jun-2000; LatestRevisionDate: 08-Jul-2005; LatestRevisionNote: Mech Layer 1 removed.; PackageReference: LED-0; Publisher: Altium Limited
D8 = SS14: SMA
F1 = Fuse 1: Fuse; Published: 8-Jun-2000; LatestRevisionDate: 17-Jul-2002; LatestRevisionNote: Re-released for DXP Platform.; PackageReference: PIN-W2/E2.8; Publisher: Altium Limited
I1 I2 L2 = Inductance3
LS1 = Bell: Electrical Bell; Published: 24-Mar-1999; LatestRevisionDate: 17-Jul-2002; LatestRevisionNote: Re-released for DXP Platform.; PackageReference: PIN2; Publisher: Altium Limited
N1 N2 = 无引脚
P1 = DC-007B
P2 P4 = Header 5: Header, 5-Pin; LatestRevisionDate: 17-Jul-2002; LatestRevisionNote: Re-released for DXP Platform.; Publisher: Altium Limited
P3 P5 = Header 9: Header, 9-Pin; LatestRevisionDate: 17-Jul-2002; LatestRevisionNote: Re-released for DXP Platform.; Publisher: Altium Limited
P6 = Header 2: Header, 2-Pin; LatestRevisionDate: 17-Jul-2002; LatestRevisionNote: Re-released for DXP Platform.; Publisher: Altium Limited
P7 = Header 28: Header, 28-Pin; LatestRevisionDate: 17-Jul-2002; LatestRevisionNote: Re-released for DXP Platform.; Publisher: Altium Limited
Q1 Q4 Q12 Q17 Q25 Q30 Q38 Q40 = S8550: PNP SOT-23; Published: 8-Jun-2000; LatestRevisionDate: 15-Jan-2003; LatestRevisionNote: PCB Footprint 'BCY-W3/D4.7' replaced; DatasheetVersion: 1997; PackageVersion: Sep-1998; PackageReference: TO-92A; Publisher: Altium Limited; Code_JEDEC: TO-92A; ComponentLink1Description: Manufacturer Link; ComponentLink1URL: http://www.fairchildsemi.com/; ComponentLink2Description: Datasheet; ComponentLink2URL: http://www.fairchildsemi.com/ds/2N%2F2N3906.pdf
Q2 Q5 Q13 Q18 Q26 Q34 Q39 Q41 = AO3401: SOT-23
Q6-Q11 Q14-Q16 Q19-Q24 Q27-Q29 Q31-Q33 Q35-Q37 = AO3400: SOT-23
R5-R129 = Res2-0603: 0603; Published: 8-Jun-2000; LatestRevisionDate: 17-Jul-2002; LatestRevisionNote: Re-released for DXP Platform.; PackageReference: AXIAL-0.4; Publisher: Altium Limited
s10 = TS-007: 五向开关
U1 = XL1509-ADJ: 开关电源 SOP-8
U2 U4 = ME6206A33M3G: LDO稳压 SOT-23
U3 = 78M05: TO-252
U5 = TL431: 稳压芯片 SOT-23
U6 = INA219AIDCNR: 26V、双向、零漂移、低侧/高侧、I2C输出电流/功率监控器
U8 U10-U12 U15 U18-U20 = XTR111: 4-20ma输出
Y1 = 晶振